# Altium schematic sheet Mgmt.SchDoc: =ProjectName
size 420 x 297 mm; Author: SBH; CompanyName: WUT; DrawnBy: SBH; Organization: ISE-WUT; Address1: Warsaw Univeristy of Technology; Address2: Nowowiejska 15/19; Revision: -; SheetNumber: 7; SheetTotal: 7; EDA_Number: ARTIQ; Projet: ARTIQ_ALTIUM/PCB_mezzanine_analog_allaki; ModifiedBy: -; CreateDate: XX/XX/XXXX; CheckedDate: -; Title2: Mgmt.SchDoc; DivGrp: ISE; Designer: SBH; ModifiedDate: -; ProjectName: ARTIQ_ALTIUM/PCB_mezzanine_analog_allaki
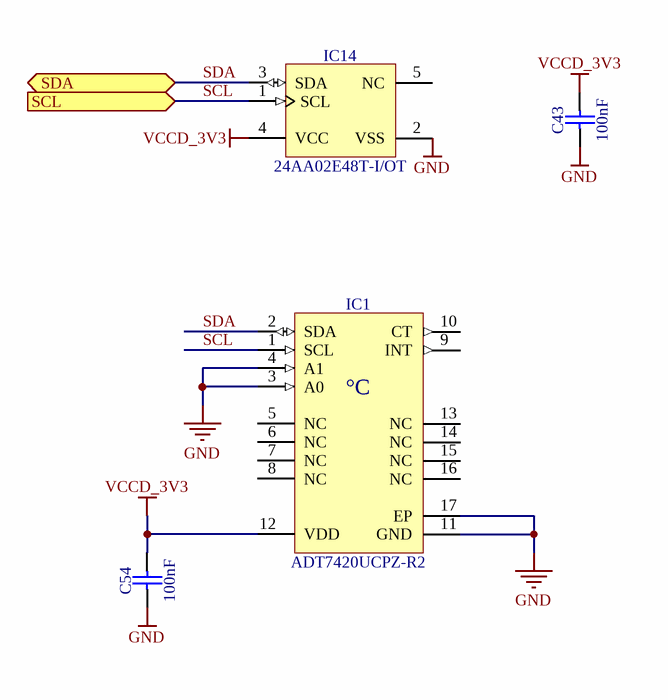
[diagram p0: Mgmt.SchDoc]

## Parts
C43  100nF  [CAPC1005X55N]
C54  100nF  [CAPC1005X55N]
IC1  ADT7420UCPZ-R2  [QFN65P400X400X80-17N-S270]
IC14  24AA02E48T-I/OT  [SOT95P280X145-5N]

## Ports
SCL (in), SDA (bidir)

## Nets
GND: C43.1 C54.1 IC1.3(A0) IC1.4(A1) IC1.11(GND) IC1.17(EP) IC14.2(VSS)
VCCD_3V3: C43.2 C54.2 IC1.12(VDD) IC14.4(VCC)
SCL: IC1.1(SCL) IC14.1(SCL) ; port SCL
SDA: IC1.2(SDA) IC14.3(SDA) ; port SDA

Not connected (* = marked no-connect by the designer): IC1 5(NC) 6(NC) 7(NC) 8(NC) 9(INT) 10(CT) 13(NC) 14(NC) 15(NC) 16(NC); IC14 5(NC)

## Notes on the sheet
- Project/Equipment
- Document
- Designer
- Drawn by
- Check.by
- File
- Last Mod.
- Print Date
- Sheet
- Size
- A3
- of
- Rev
- (in symbol ADT7420UCPZ-R2) °C

## Library data of the parts
C43 C54 = CC0402_100NF_16V_10%_X5R: Non-polarised capacitor; Part Description: SMD Multilayer Chip Ceramic Capacitor; Manufacturer: GENERIC; Manufacturer1 Part Number: GRM155R61C104KA88D; Voltage: 16V; TC: X5R; Tolerance: ±10%; Part Number: CC0402_100NF_16V_10%_X5R; Component Kind: Standard; Component Type: Standard; Pin Count: 2; Value: 100nF; Status: None; Manufacturer Part Number: CC0402_100NF_16V_10%_X5R; Case: 0402; Mounted: Yes; Socket: No; SMD: Yes; Sense: No; Manufacturer1 Example: MURATA; Manufacturer1 ComponentHeight: 0.55mm; HelpURL: \\cern.ch\dfs\Applications\Altium\Datasheets\CC0402_X5R_MURATA_GRM.pdf; Author: CERN DEM JLC; CreateDate: 10.12.2013; LatestRevisionDate: 10.12.2013
IC1 = ADT7420UCPZ-R2: ±0.25°C Accurate, 16-Bit Digital I2C Temperature Sensor; Part Description: -20° to +105°C ±0.25°C Accurate, 16-Bit Digital I2C Temperature Sensor; Manufacturer: ANALOG DEVICES; PressFit: No; Bonding: No; Part Number: ADT7420UCPZ-R2; Component Kind: Standard; Component Type: Standard; Device: ADT7420UCPZ-R2; PackageDescription: QFN, 0.65mm Pitch, Square; 16 Pin, 4.00mm L X 4.00mm W X 0.80mm H Body (w/thermal tab 2.7 X 2.7mm),  IPC Medium Density; Manufacturer Part Number: ADT7420UCPZ-R2; Pin Count: 8; Case: QFN16; Mounted: Yes; Socket: No; SMD: Yes; Sense: No; ComponentHeight: 0.8mm; HelpURL: \\cern.ch\dfs\Applications\Altium\Datasheets\ADT7420UCPZ-R2.pdf; Author: CERN DEM JLC; CreateDate: 2013-02-21; LatestRevisionDate: 2013-02-21
IC14 = 24AA02E48T-I/OT: 1.7V-5.5V, 2K I2C Serial EEPROM With EUI-48 Node Identity; Manufacturer: MICROCHIP TECHNOLOGY; PressFit: No; Bonding: No; Part Number: 24AA02E48T-I/OT; Component Kind: Standard; Component Type: Standard; Device: 24AA02E48T-I/OT; PackageDescription: SOT, 0.95mm pitch; 5 pin, 1.60mm W X 2.90mm L X 1.45mm H body, IPC Medium Density; Part Description: 1.7V-5.5V, 2K I2C Serial EEPROM With EUI-48 Node Identity; Manufacturer Part Number: 24AA02E48T-I/OT; Pin Count: 5; Case: SOT23-5; Mounted: Yes; Socket: No; SMD: Yes; Sense: No; ComponentHeight: 1.45mm; HelpURL: \\cern.ch\dfs\Applications\Altium\Datasheets\24AA02E48T-I-OT.pdf; Author: CERN DEM MR; CreateDate: 31.03.2016; LatestRevisionDate: 31.03.2016